# Altium schematic sheet WX0.011.105DL.SchDoc
size A3
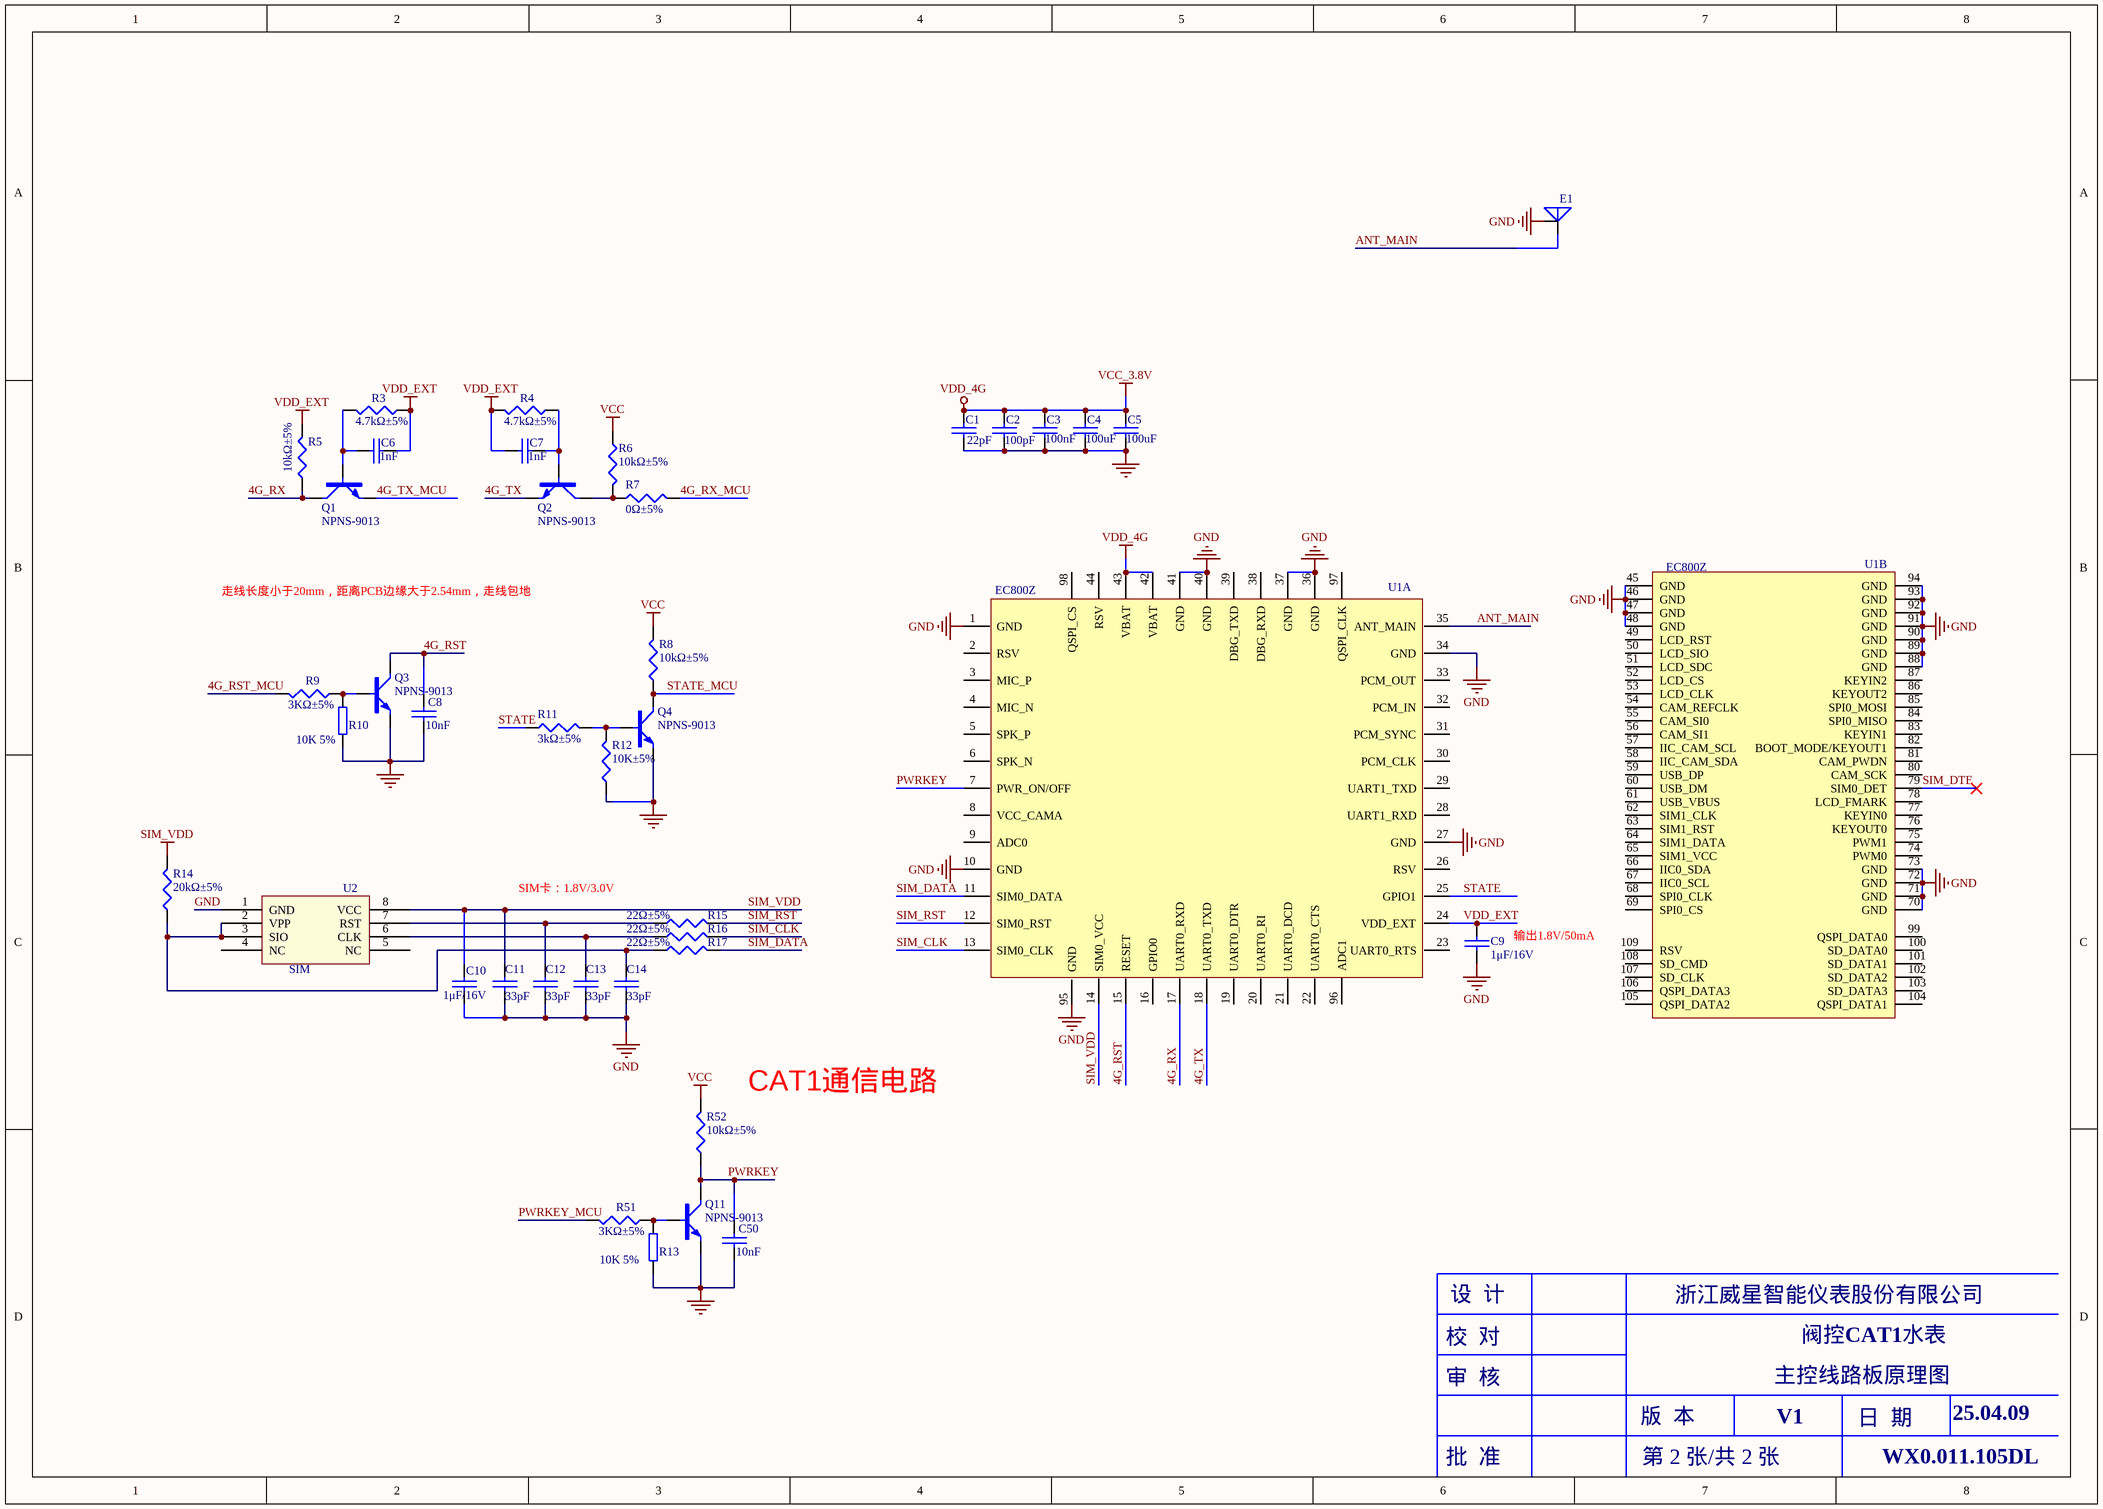
[diagram p0: WX0.011.105DL.SchDoc]

## Parts
C1  22pF  [CAP0603]
C2  100pF  [CAP0603]
C3  100nF  [CAP0603]
C4  100uF  [GRM1206]
C5  100uF  [GRM1206]
C6  1nF  [CAP0603]
C7  1nF  [CAP0603]
C8  10nF  [CAP0603]
C9  1μF/16V  [CAP0603]
C10  1μF/16V  [CAP0603]
C11  33pF  [CAP0603]
C12  33pF  [CAP0603]
C13  33pF  [CAP0603]
C14  33pF  [CAP0603]
C50  10nF  [CAP0603]
E1  ANTENNA_3  [天线]  (value not drawn)
Q1  NPNS-9013  [SOT-23]
Q2  NPNS-9013  [SOT-23]
Q3  NPNS-9013  [SOT-23]
Q4  NPNS-9013  [SOT-23]
Q11  NPNS-9013  [SOT-23]
R3  4.7kΩ±5%  [RES0603]
R4  4.7kΩ±5%  [RES0603]
R5  10kΩ±5%  [RES0603]
R6  10kΩ±5%  [RES0603]
R7  0Ω±5%  [RES0603]
R8  10kΩ±5%  [RES0603]
R9  3KΩ±5%  [RES0603]
R10  10K 5%  [RES0603]
R11  3kΩ±5%  [RES0603]
R12  10K±5%  [RES0603]
R13  10K 5%  [RES0603]
R14  20kΩ±5%  [RES0603]
R15  22Ω±5%  [RES0603]
R16  22Ω±5%  [RES0603]
R17  22Ω±5%  [RES0603]
R51  3KΩ±5%  [RES0603]
R52  10kΩ±5%  [RES0603]
U1  EC800Z  [MOD_ML307X_LGA109P]  (parts A,B of 2)
U2  SIM  [SIMIC]

## Nets
GND: C1.1 C2.1 C3.1 C4.1 C5.1 C8.1 C9.1 C10.1 C11.1 C12.1 C13.1 C14.1 C50.1 E1.2 Q3.2(E) Q4.2(E) Q11.2(E) R10.1 R12.1 R13.1 U1.1(GND) U1.10(GND) U1.27(GND) U1.34(GND) U1.36(GND) U1.37(GND) U1.40(GND) U1.41(GND) U1.45(GND) U1.46(GND) U1.47(GND) U1.48(GND) U1.70(GND) U1.71(GND) U1.72(GND) U1.73(GND) U1.88(GND) U1.89(GND) U1.90(GND) U1.91(GND) U1.92(GND) U1.93(GND) U1.94(GND) U1.95(GND) U2.1(GND)
SIM_VDD: C10.2 C11.2 R14.2 U1.14(SIM0_VCC) U2.8(VCC)
VCC: R6.1 R8.2 R52.2
VCC_3.8V: C1.2 C2.2 C3.2 C4.2 C5.2 U1.42(VBAT) U1.43(VBAT)  [also labelled VDD_4G]
VDD_EXT: C6.2 C7.1 C9.2 R3.1 R4.2 R5.2 U1.24(VDD_EXT)
4G_RST: C8.2 Q3.3(C) U1.15(RESET)
4G_RST_MCU: R9.2
4G_RX: Q1.3(C) R5.1 U1.17(UART0_RXD)
4G_RX_MCU: R7.2
4G_TX: Q2.2(E) U1.18(UART0_TXD)
4G_TX_MCU: Q1.2(E)
ANT_MAIN: E1.1(A) U1.35(ANT_MAIN)
PWRKEY: C50.2 Q11.3(C) R52.1 U1.7(PWR_ON/OFF)
PWRKEY_MCU: R51.2
SIM_CLK: R16.2 U1.13(SIM0_CLK)
SIM_DATA: R17.2 U1.11(SIM0_DATA)
SIM_DTE: U1.79(SIM0_DET)
SIM_RST: R15.2 U1.12(SIM0_RST)
STATE: R11.1 U1.25(GPIO1)
STATE_MCU: Q4.3(C) R8.1
NetC6_1: C6.1 Q1.1(B) R3.2
NetC7_2: C7.2 Q2.1(B) R4.1
NetC12_2: C12.2 R15.1 U2.7(RST)
NetC13_2: C13.2 R16.1 U2.6(CLK)
NetC14_2: C14.2 R14.1 R17.1 U2.2(VPP) U2.3(SIO)
NetQ2_3: Q2.3(C) R6.2 R7.1
NetQ3_1: Q3.1(B) R9.1 R10.2
NetQ4_1: Q4.1(B) R11.2 R12.2
NetQ11_1: Q11.1(B) R13.2 R51.1

Not connected (* = marked no-connect by the designer): U1 2(RSV) 3(MIC_P) 4(MIC_N) 5(SPK_P) 6(SPK_N) 8(VCC_CAMA) 9(ADC0) 16(GPIO0) 19(UART0_DTR) 20(UART0_RI) 21(UART0_DCD) 22(UART0_CTS) 23(UART0_RTS) 26(RSV) 28(UART1_RXD) 29(UART1_TXD) 30(PCM_CLK) 31(PCM_SYNC) 32(PCM_IN) 33(PCM_OUT) 38(DBG_RXD) 39(DBG_TXD) 44(RSV) 49(LCD_RST) 50(LCD_SIO) 51(LCD_SDC) 52(LCD_CS) 53(LCD_CLK) 54(CAM_REFCLK) 55(CAM_SI0) 56(CAM_SI1) 57(IIC_CAM_SCL) 58(IIC_CAM_SDA) 59(USB_DP) 60(USB_DM) 61(USB_VBUS) 62(SIM1_CLK) 63(SIM1_RST) 64(SIM1_DATA) 65(SIM1_VCC) 66(IIC0_SDA) 67(IIC0_SCL) 68(SPI0_CLK) 69(SPI0_CS) 74(PWM0) 75(PWM1) 76(KEYOUT0) 77(KEYIN0) 78(LCD_FMARK) 80(CAM_SCK) 81(CAM_PWDN) 82(BOOT_MODE/KEYOUT1) 83(KEYIN1) 84(SPI0_MISO) 85(SPI0_MOSI) 86(KEYOUT2) 87(KEYIN2) 96(ADC1) 97(QSPI_CLK) 98(QSPI_CS) 99(QSPI_DATA0) 100(SD_DATA0) 101(SD_DATA1) 102(SD_DATA2) 103(SD_DATA3) 104(QSPI_DATA1) 105(QSPI_DATA2) 106(QSPI_DATA3) 107(SD_CLK) 108(SD_CMD) 109(RSV); U2 4(NC) 5(NC)

## Notes on the sheet
- 走线长度小于20mm，距离PCB边缘大于2.54mm，走线包地
- SIM卡：1.8V/3.0V
- (near C9) 输出1.8V/50mA
- (near R52) CAT1通信电路
- 设  计
- 浙江威星智能仪表股份有限公司
- 审  核
- 校  对
- 主控线路板原理图
- 阀控CAT1水表
- 版  本
- V1
- 日  期
- 25.04.09
- 批  准
- 第 2 张/共 2 张
- WX0.011.105DL

## Library data of the parts
C1 = 3: 贴片电容,22pF±5%/50V,NP0,国巨; Part Number: 101020103-0009; Manufacturer P/N: CC0603JRNPO9BN22; ID: 3; Part Name: 贴片电容; Manufacturer: 国巨
C2 = 9: 贴片电容,100pF±10%/50V,NP0,国巨; Part Number: 101020103-0010; Manufacturer P/N: CC0603JRNPO9BN101; ID: 9; Part Name: 贴片电容; Manufacturer: 国巨
C3 = 1: 贴片电容,100nF±10%/50V,X7R,国巨; Part Number: 101020103-0021; Manufacturer P/N: CC0603KRX7R9BB104; ID: 1; Part Name: 贴片电容; Manufacturer: 国巨
C4 C5 = 16: 贴片电容,100uF±20%/6.3V,X5R,村田; Part Number: 101020101-0020; Manufacturer P/N: GRM31CR60J107ME39L; ID: 16; Part Name: 贴片电容; Manufacturer: 村田
C6 C7 = 6: 贴片电容,1nF±10%/50V,X7R,国巨; Part Number: 101020103-0022; Manufacturer P/N: CC0603KRX7R9BB102; ID: 6; Part Name: 贴片电容; Manufacturer: 国巨
C8 C50 = 5: 贴片电容,10nF±10%/50V,X7R,国巨; Part Number: 101020103-0007; Manufacturer P/N: CC0603KRX7R9BB103; ID: 5; Part Name: 贴片电容; Manufacturer: 国巨
C9 C10 = 2: 贴片电容,1μF±10%/16V,X7R,国巨; Part Number: 101020103-0003; Manufacturer P/N: CC0603KRX7R7BB105; ID: 2; Part Name: 贴片电容; Manufacturer: 国巨
C11-C14 = 4: 贴片电容,33pF±10%/50V,NP0,国巨; Part Number: 101020103-0027; Manufacturer P/N: CC0603KRNPO9BN33; ID: 4; Part Name: 贴片电容; Manufacturer: 国巨
E1 = 28: 外置天线焊盘（固定孔）; Part Name: 虚拟器件; ID: 28; Part Number: *
Q1-Q4 Q11 = 101040201-0002: 9013,NPN,SOT-23,长电,S9013; Part Name: 贴片三极管; ID: 14; SMD/DIP: SMD; Part Number: 101040201-0002
R3 R4 R9 R11 R14 R51 = 12: 贴片电阻,4.7kΩ±5%,1/10W,100ppm/℃,国巨; Part Number: 101010103-0042; Manufacturer P/N: RC0603JR-074K7L; ID: 12; Part Name: 贴片电阻; Manufacturer: 国巨
R5 R6 R8 R52 = 2: 贴片电阻,10kΩ±5%,1/10W,100ppm/℃,国巨; Part Number: 101010103-0003; Manufacturer P/N: RC0603JR-0710KL; ID: 2; Part Name: 贴片电阻; Manufacturer: 国巨
R7 = 15: 贴片电阻,0Ω±5%,1/10W,100ppm/℃,国巨; Part Number: 101010103-0001; Manufacturer P/N: RC0603JR-070RL; ID: 15; Part Name: 贴片电阻; Manufacturer: 国巨
R10 R13 = 101010103-0003: 国巨,±5%,0603,,155 ℃,-55 ℃,RC0603JR-0710KL,无铅,200 ppm/℃,1/10W,,10K; Part Name: 0603贴片电阻; ID: 7; SMD/DIP: SMD; Part Number: 101010103-0003
R12 = 22: 贴片电阻，47K,±5%,1/10W,0603,国巨,RC0603JR-0747KL; Part Number: 101010103-0012; Part Name: 贴片电阻; ID: 22; Manufacturer: 国巨; Manufacturer P/N: RC0603JR-0747KL
R15-R17 = 14: 贴片电阻,22Ω±5%,1/10W,100ppm/℃,国巨; Part Number: 101010103-0009; Manufacturer P/N: RC0603JR-0722RL; ID: 14; Part Name: 贴片电阻; Manufacturer: 国巨
U1 = 15: 集成电路,中国移动，ML307R; Manufacturer: 中国移动; Vendor: 中移物联网有限公司; Value: ML307X; ID: 15; PCB DECAL: MOD_ML307X_LGA109P; Part Name: 集成电路
U2 = 2: 集成电路,ESIM,杭州电信; Part Number: 101050101-0120; Manufacturer: 电信; ID: 2; Part Name: 集成电路